# Altium schematic sheet Analog.SchDoc
size B
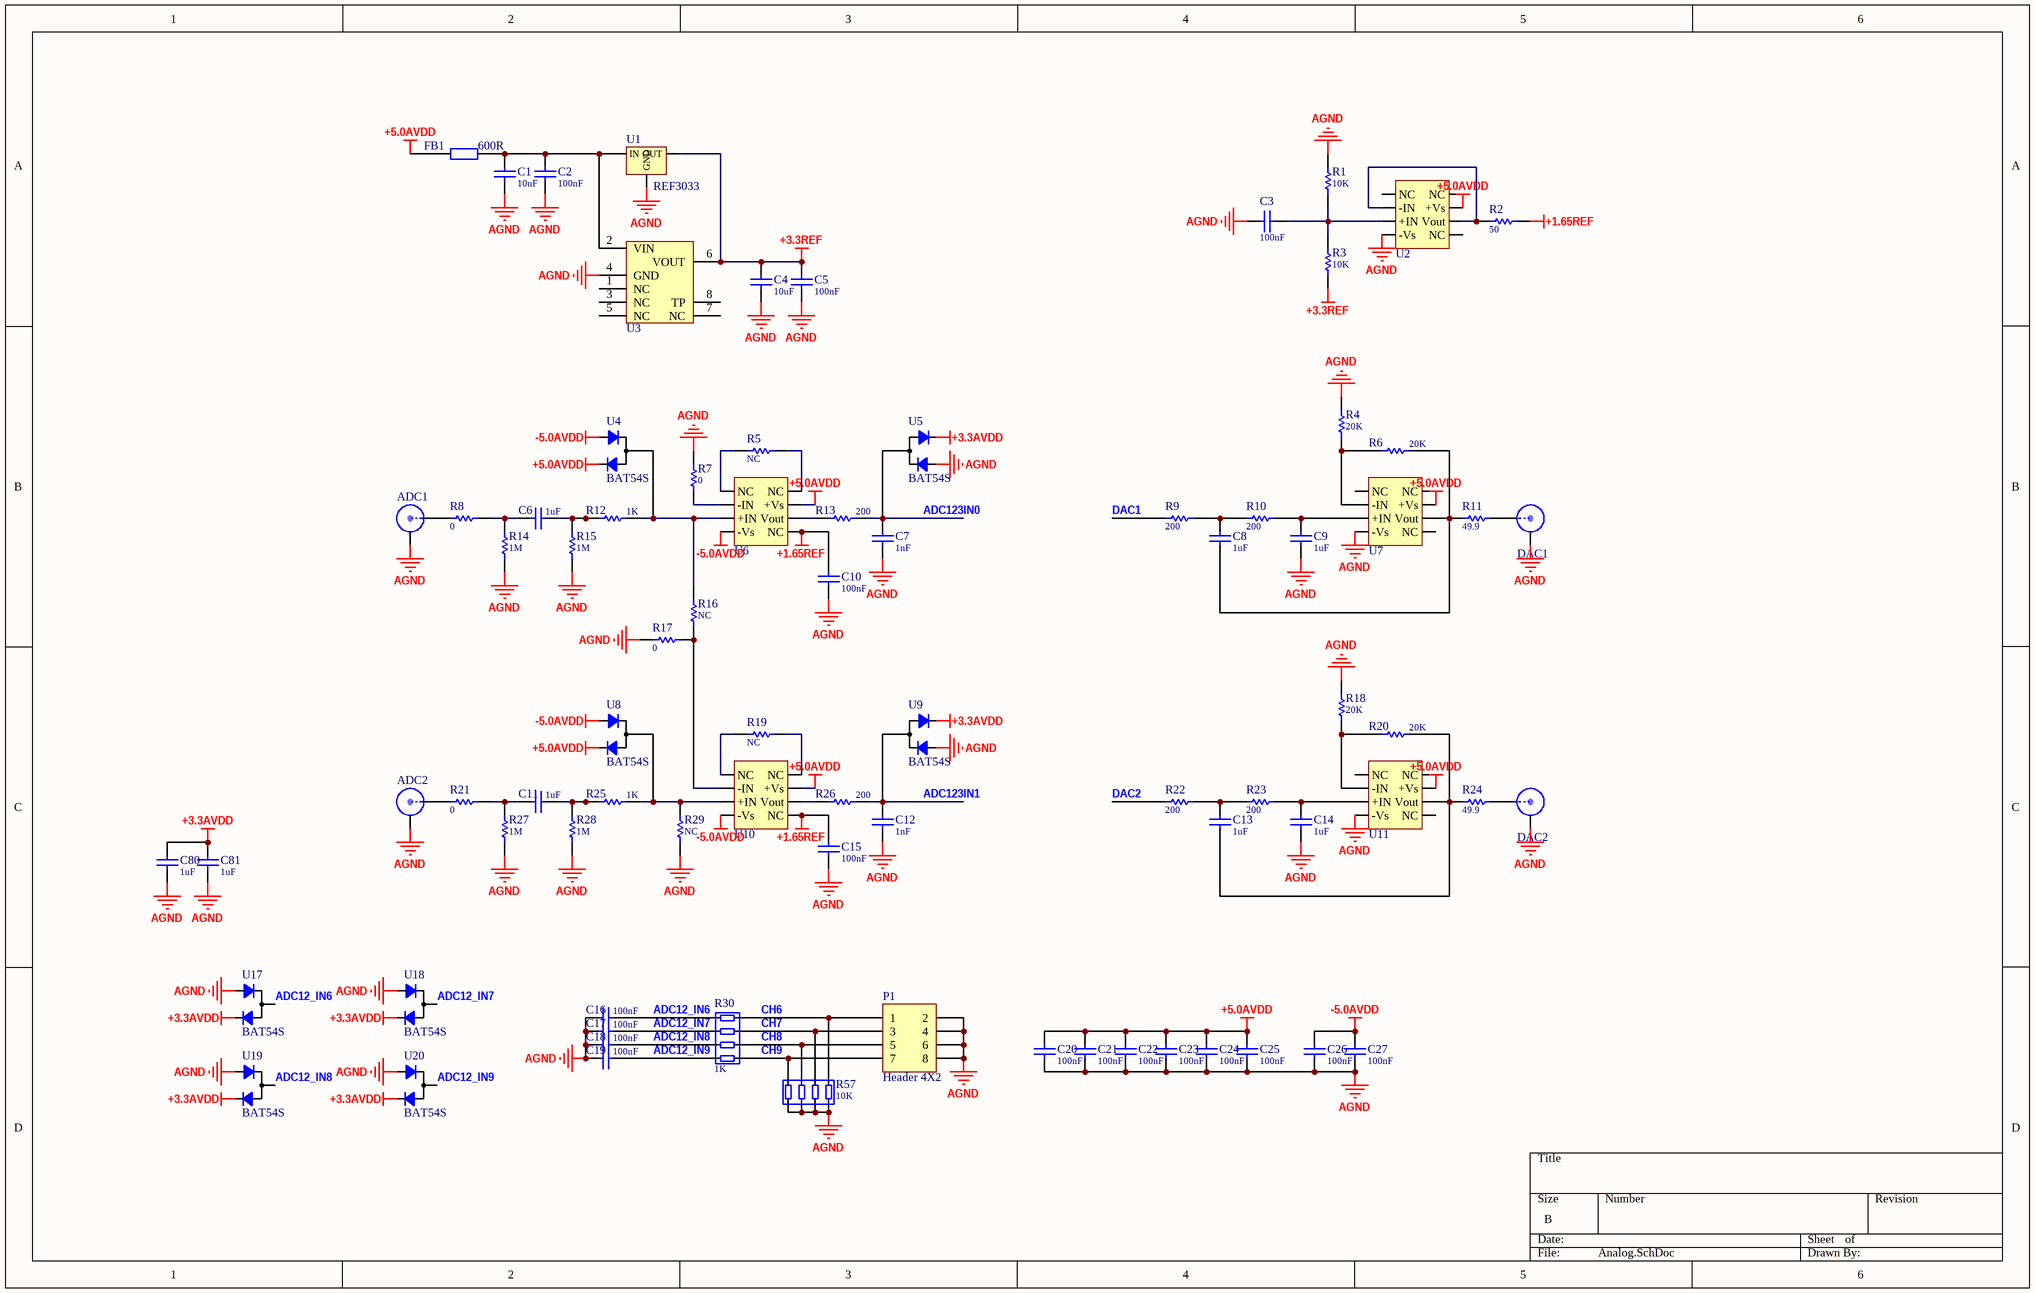
[diagram p0: Analog.SchDoc]

## Parts
ADC1  SMA  [SMA_ANGLE]  (value not drawn)
ADC2  SMA  [SMA_ANGLE]  (value not drawn)
C1  value 10uF  [C0603-L]  (hidden comment: Cap-S)
C2  value 100nF  [C0603-L]  (hidden comment: Cap-S)
C3  value 100nF  [C0603-L]  (hidden comment: Cap-S)
C4  value 10uF  [C0603-L]  (hidden comment: Cap-S)
C5  value 100nF  [C0603-L]  (hidden comment: Cap-S)
C6  value 1uF  [C0603-L]  (hidden comment: Cap-S)
C7  value 1nF  [C0603-L]  (hidden comment: Cap-S)
C8  value 1uF  [C0603-L]  (hidden comment: Cap-S)
C9  value 1uF  [C0603-L]  (hidden comment: Cap-S)
C10  value 100nF  [C0603-L]  (hidden comment: Cap-S)
C11  value 1uF  [C0603-L]  (hidden comment: Cap-S)
C12  value 1nF  [C0603-L]  (hidden comment: Cap-S)
C13  value 1uF  [C0603-L]  (hidden comment: Cap-S)
C14  value 1uF  [C0603-L]  (hidden comment: Cap-S)
C15  value 100nF  [C0603-L]  (hidden comment: Cap-S)
C16  value 100nF  [C0603-L]  (hidden comment: Cap-S)
C17  value 100nF  [C0603-L]  (hidden comment: Cap-S)
C18  value 100nF  [C0603-L]  (hidden comment: Cap-S)
C19  value 100nF  [C0603-L]  (hidden comment: Cap-S)
C20  value 100nF  [C0603-L]  (hidden comment: Cap-S)
C21  value 100nF  [C0603-L]  (hidden comment: Cap-S)
C22  value 100nF  [C0603-L]  (hidden comment: Cap-S)
C23  value 100nF  [C0603-L]  (hidden comment: Cap-S)
C24  value 100nF  [C0603-L]  (hidden comment: Cap-S)
C25  value 100nF  [C0603-L]  (hidden comment: Cap-S)
C26  value 100nF  [C0603-L]  (hidden comment: Cap-S)
C27  value 100nF  [C0603-L]  (hidden comment: Cap-S)
C80  value 1uF  [C0603-L]  (hidden comment: Cap-S)
C81  value 1uF  [C0603-L]  (hidden comment: Cap-S)
DAC1  SMA  [SMA_ANGLE]  (value not drawn)
DAC2  SMA  [SMA_ANGLE]  (value not drawn)
FB1  600R  [FB-0805]
P1  Header 4X2  [HDR2X4]
R1  value 10K  [R0603-L]  (hidden comment: R)
R2  value 50  [R0603-L]  (hidden comment: R)
R3  value 10K  [R0603-L]  (hidden comment: R)
R4  value 20K  [R0603-L]  (hidden comment: R)
R5  value NC  [R0603-L]  (hidden comment: R)
R6  value 20K  [R0603-L]  (hidden comment: R)
R7  value 0  [R0603-L]  (hidden comment: R)
R8  value 0  [R0603-L]  (hidden comment: R)
R9  value 200  [R0603-L]  (hidden comment: R)
R10  value 200  [R0603-L]  (hidden comment: R)
R11  value 49.9  [R0603-L]  (hidden comment: R)
R12  value 1K  [R0603-L]  (hidden comment: R)
R13  value 200  [R0603-L]  (hidden comment: R)
R14  value 1M  [R0603-L]  (hidden comment: R)
R15  value 1M  [R0603-L]  (hidden comment: R)
R16  value NC  [R0603-L]  (hidden comment: R)
R17  value 0  [R0603-L]  (hidden comment: R)
R18  value 20K  [R0603-L]  (hidden comment: R)
R19  value NC  [R0603-L]  (hidden comment: R)
R20  value 20K  [R0603-L]  (hidden comment: R)
R21  value 0  [R0603-L]  (hidden comment: R)
R22  value 200  [R0603-L]  (hidden comment: R)
R23  value 200  [R0603-L]  (hidden comment: R)
R24  value 49.9  [R0603-L]  (hidden comment: R)
R25  value 1K  [R0603-L]  (hidden comment: R)
R26  value 200  [R0603-L]  (hidden comment: R)
R27  value 1M  [R0603-L]  (hidden comment: R)
R28  value 1M  [R0603-L]  (hidden comment: R)
R29  value NC  [R0603-L]  (hidden comment: R)
R30  value 1K  [R0603X4]  (hidden comment: R)
R57  value 10K  [R0603X4]  (hidden comment: R)
U1  REF3033  [SOT23-3_N]
U2  OPA657  [SOIC-8_N]  (value not drawn)
U3  ADR45xx  [SOIC-8_N]  (value not drawn)
U4  BAT54S  [SOT-23-3]
U5  BAT54S  [SOT-23-3]
U6  OPA657  [SOIC-8_N]  (value not drawn)
U7  OPA657  [SOIC-8_N]  (value not drawn)
U8  BAT54S  [SOT-23-3]
U9  BAT54S  [SOT-23-3]
U10  OPA657  [SOIC-8_N]  (value not drawn)
U11  OPA657  [SOIC-8_N]  (value not drawn)
U17  BAT54S  [SOT-23-3]
U18  BAT54S  [SOT-23-3]
U19  BAT54S  [SOT-23-3]
U20  BAT54S  [SOT-23-3]

## Nets
+1.65REF: C10.1 C15.1 R2.1 U6.5(NC) U10.5(NC)
+3.3AVDD: C80.1 C81.1 U5.3 U9.3 U17.3 U18.3 U19.3 U20.3
+3.3REF: C4.2 C5.2 R3.1 U1.2(OUT) U3.6(VOUT)
+5.0AVDD: C20.1 C21.1 C22.1 C23.1 C24.1 C25.1 FB1.1 U2.7(+Vs) U4.3 U6.7(+Vs) U7.7(+Vs) U8.3 U10.7(+Vs) U11.7(+Vs)
-5.0AVDD: C26.1 C27.1 U4.1 U6.4(-Vs) U8.1 U10.4(-Vs)
AGND: ADC1.2 ADC2.2 C1.1 C2.1 C3.2 C4.1 C5.1 C7.1 C9.2 C10.2 C12.1 C14.2 C15.2 C16.2 C17.2 C18.2 C19.2 C20.2 C21.2 C22.2 C23.2 C24.2 C25.2 C26.2 C27.2 C80.2 C81.2 DAC1.2 DAC2.2 P1.2 P1.4 P1.6 P1.8 R1.2 R4.2 R7.2 R14.1 R15.1 R17.2 R18.2 R27.1 R28.1 R29.2 R57.5 R57.6 R57.7 R57.8 U1.3(GND) U2.4(-Vs) U3.4(GND) U5.1 U7.4(-Vs) U9.1 U11.4(-Vs) U17.1 U18.1 U19.1 U20.1
ADC12_IN6: C16.1 R30.8 U17.2
ADC12_IN7: C17.1 R30.7 U18.2
ADC12_IN8: C18.1 R30.6 U19.2
ADC12_IN9: C19.1 R30.5 U20.2
ADC123IN0: C7.2 R13.2 U5.2
ADC123IN1: C12.2 R26.2 U9.2
CH6: P1.1 R30.1 R57.4
CH7: P1.3 R30.2 R57.3
CH8: P1.5 R30.3 R57.2
CH9: P1.7 R30.4 R57.1
DAC1: R9.2
DAC2: R22.2
NetADC1_1: ADC1.1 R8.2
NetADC2_1: ADC2.1 R21.2
NetC1_2: C1.2 C2.2 FB1.2 U1.1(IN) U3.2(VIN)
NetC3_1: C3.1 R1.1 R3.2 U2.3(+IN)
NetC6_1: C6.1 R12.1 R15.2
NetC6_2: C6.2 R8.1 R14.2
NetC8_1: C8.1 R9.1 R10.2
NetC8_2: C8.2 R6.2 R11.2 U7.6(Vout)
NetC9_1: C9.1 R10.1 U7.3(+IN)
NetC11_1: C11.1 R25.1 R28.2
NetC11_2: C11.2 R21.1 R27.2
NetC13_1: C13.1 R22.1 R23.2
NetC13_2: C13.2 R20.2 R24.2 U11.6(Vout)
NetC14_1: C14.1 R23.1 U11.3(+IN)
NetDAC1_1: DAC1.1 R11.1
NetDAC2_1: DAC2.1 R24.1
NetR2_2: R2.2 U2.2(-IN) U2.6(Vout)
NetR4_1: R4.1 R6.1 U7.2(-IN)
NetR5_1: R5.1 U6.8(NC)
NetR5_2: R5.2 U6.1(NC)
NetR7_1: R7.1 U6.2(-IN)
NetR12_2: R12.2 R16.2 U4.2 U6.3(+IN)
NetR13_1: R13.1 U6.6(Vout)
NetR16_1: R16.1 R17.1 U10.2(-IN)
NetR18_1: R18.1 R20.1 U11.2(-IN)
NetR19_1: R19.1 U10.8(NC)
NetR19_2: R19.2 U10.1(NC)
NetR25_2: R25.2 R29.1 U8.2 U10.3(+IN)
NetR26_1: R26.1 U10.6(Vout)

Not connected (* = marked no-connect by the designer): U2 1(NC) 5(NC) 8(NC); U3 1(NC) 3(NC) 5(NC) 7(NC) 8(TP); U7 1(NC) 5(NC) 8(NC); U11 1(NC) 5(NC) 8(NC)

## Library data of the parts
C1-C27 C80 C81 = Cap-S: 贴片瓷片电容
FB1 = FB
P1 = Header 4X2: Header, 4-Pin, Dual row; LatestRevisionDate: 17-Jul-2002; LatestRevisionNote: Re-released for DXP Platform.; Publisher: Altium Limited
R1-R29 = Res: 贴片电阻
R30 R57 = Res-4R: 排阻 4
U1 = REF3025: 采用 SOT23-3 封装的 2.5V 输出 50ppm/℃ 漂移 50uA 静态电流的（带隙）电压参考
U2 U6 U7 U10 U11 = OPA657: 1.6-GHz, Low-Noise, FET-Input Operational Amplifier; Manufacturer: Texas Instruments; PartNumber: OPA656U; 2nd Harmonic(dBc): 74; 3rd Harmonic(dBc): 100; @ MHz: 5; Acl, min stable gain(V/V): 1; BW @ Acl(MHz): 500; Diff Gain(%): 0.02; Diff Phase(deg): 0.05; Eco-Plan: Green (RoHS & no Sb/Br); Io(Typ)(mA): 70; Iq per channel(Max)(mA): 16; Slew Rate(Typ)(V/us): 290; Sub Family: High Output Current Amplifier (>=50mA), High Speed Amplifier (>=50MHz), Low Input Bias Current Amp (<=10pA); THD (Fc is 1 MHz)(Typ)(dB): -74; Vio(Max)(mV): 0.6; Vn at Flatband(Typ)(nV/rtHz): 7; Vs(Max)(V): 12; Vs(Min)(V): 10; DatasheetVersion: SBOS196G; PackageVersion: 4040047-3/M, 06/2011; PackageReference: D8; PackageDescription: 8-Pin Plastic Small Outline, Body 4.9 x 3.9 mm, Pitch 1.27 mm; Supplier 1: Digi-Key; Supplier Part Number 1: OPA656U-ND; Supplier 2: Farnell; Supplier Part Number 2: 1212322; Supplier 3: Newark; Supplier Part Number 3: 75C5137; Supplier 4: Mouser; Supplier Part Number 4: 595-OPA656U; Iib(Max)(nA): 0.02; Number of Channels: 1; Settling Time (0.1%)(Typ)(ns): 16; Mounting Technology: Surface Mount; Code_JEDEC: MS-012; ComponentLink1Description: Manufacturer URL; ComponentLink1URL: http://www.ti.com/; ComponentLink2Description: Datasheet; ComponentLink2URL: http://www.ti.com/general/docs/lit/getliterature.tsp?genericPartNumber=OPA656&fileType=pdf; ComponentLink3Description: Package Specification; ComponentLink3URL: http://www.ti.com/litv/pdf/msoi002j
U3 = ADR45xx: 超低噪声、高精度  基准电压源